# EAGLE schematic untitled2-6-1 (EAGLE 9.6.2)
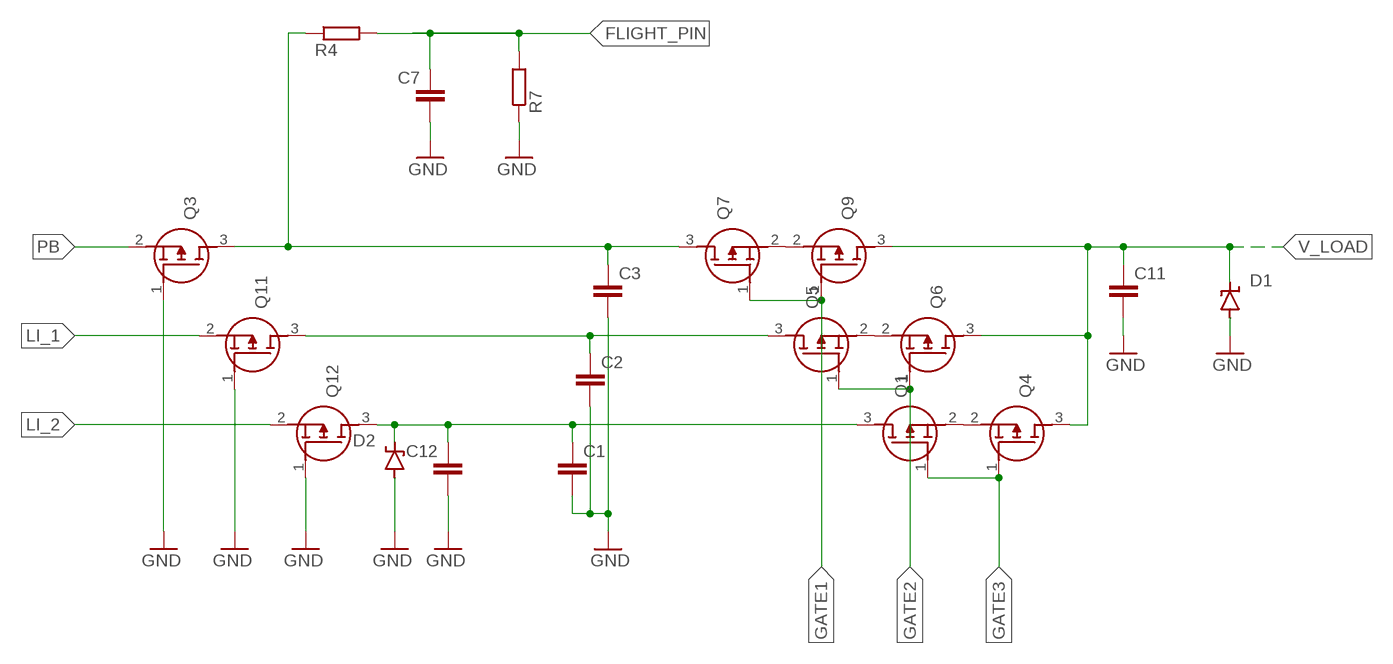
[diagram p0: schematic, sheet 1]

## Parts
C1  100E-9F  C-EUC0805  [C0805]
C2  100E-9F  C-EUC0805  [C0805]
C3  100E-9F  C-EUC0805  [C0805]
C7  100E-9F  C-EUC0805  [C0805]
C11  100E-6F  C-EUC0805  [C0805]
C12  100E-9F  C-EUC0805  [C0805]
D1  SUPPRESSOR-SMBJ  [SMBJ]
D2  SUPPRESSOR-SMBJ  [SMBJ]
Q1  SSM3J332R,LF  [2-3Z1S(SOT-23F)]
Q3  SSM3J332R,LF  [2-3Z1S(SOT-23F)]
Q4  SSM3J332R,LF  [2-3Z1S(SOT-23F)]
Q5  SSM3J332R,LF  [2-3Z1S(SOT-23F)]
Q6  SSM3J332R,LF  [2-3Z1S(SOT-23F)]
Q7  SSM3J332R,LF  [2-3Z1S(SOT-23F)]
Q9  SSM3J332R,LF  [2-3Z1S(SOT-23F)]
Q11  SSM3J332R,LF  [2-3Z1S(SOT-23F)]
Q12  SSM3J332R,LF  [2-3Z1S(SOT-23F)]
R4  1E2Ω  R-EU_R0603  [R0603]
R7  1E2Ω  R-EU_R0603  [R0603]

## Nets
FLIGHT_PIN: C7.1 R4.2 R7.2
GATE1: Q7.1(G) Q9.1(G)
GATE2: Q5.1(G) Q6.1(G)
GATE3: Q1.1(G) Q4.1(G)
GND [VCC]: C1.2 C2.2 C3.2 C7.2 C11.2 C12.2 D1.A D2.A Q3.1(G) Q11.1(G) Q12.1(G) R7.1
LI_1: Q11.2(S)
LI_2: Q12.2(S)
N$17: Q1.2(S) Q4.2(S)
N$21: Q5.2(S) Q6.2(S)
N$23: Q7.2(S) Q9.2(S)
PB [VIN]: Q3.2(S)
V1: C3.1 Q3.3(D) Q7.3(D) R4.1
V2: C2.1 Q5.3(D) Q11.3(D)
V3: C1.1 C12.1 D2.C Q1.3(D) Q12.3(D)
V_LOAD: C11.1 D1.C Q4.3(D) Q6.3(D) Q9.3(D)

## Library data of the parts
C1-C3 C7 C11 C12 = rcl:C-EU: CAPACITOR, European symbol; SPICEPREFIX: C
D1 D2 = diode:SUPPRESSOR-: Suppressor diode
Q1 Q3-Q7 Q9 Q11 Q12 = SamacSys_Parts:SSM3J332R,LF: MOSFET SM Sig P-CH MOS 12V VGSS -6A -30VDSS Source: Datasheet; DESCRIPTION: MOSFET SM Sig P-CH MOS 12V VGSS -6A -30VDSS; HEIGHT: mm; MANUFACTURER_NAME: Toshiba; MANUFACTURER_PART_NUMBER: SSM3J332R,LF; MOUSER_PART_NUMBER: 757-SSM3J332RLF; MOUSER_PRICE-STOCK: https://www.mouser.co.uk/ProductDetail/Toshiba/SSM3J332RLF?qs=%252B8yZ8wZTKG5UW86maIHWeg%3D%3D
R4 R7 = rcl:R-EU_: RESISTOR, European symbol; SPICEPREFIX: R

## Net classes
1 supply: width 0.15 mm
2 VDD: width 0.254 mm
3 VCC: width 0.305 mm
4 VIN: width 0.61 mm